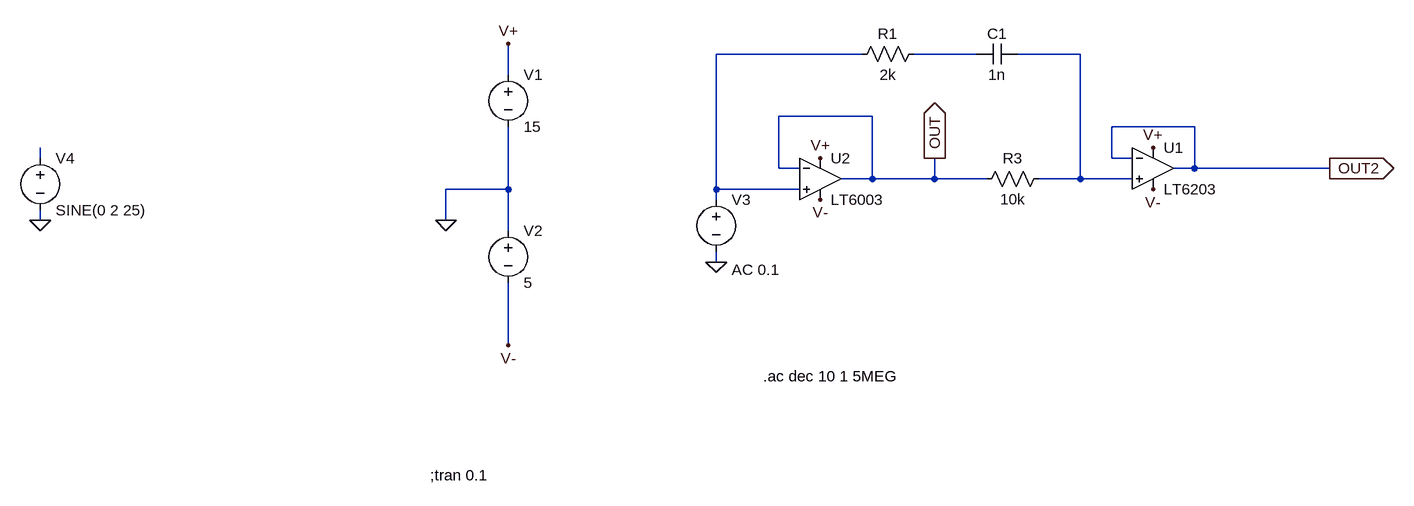
[diagram p0: schematic ac_bypass.asc]
ac_bypass.asc, the LTspice schematic file:
Version 4
SHEET 1 956 700
WIRE 112 32 -112 32
WIRE 288 32 192 32
WIRE 448 32 352 32
WIRE -432 64 -432 16
WIRE 128 128 -16 128
WIRE 624 144 496 144
WIRE -1152 192 -1152 176
WIRE 496 192 496 144
WIRE 528 192 496 192
WIRE -16 208 -16 128
WIRE 16 208 -16 208
WIRE 624 208 624 144
WIRE 624 208 592 208
WIRE 832 208 624 208
WIRE 128 224 128 128
WIRE 128 224 80 224
WIRE 224 224 224 192
WIRE 224 224 128 224
WIRE 304 224 224 224
WIRE 448 224 448 32
WIRE 448 224 384 224
WIRE 528 224 448 224
WIRE -432 240 -432 144
WIRE -432 240 -528 240
WIRE -112 240 -112 32
WIRE 16 240 -112 240
WIRE -112 256 -112 240
WIRE -1152 288 -1152 272
WIRE -528 288 -528 240
WIRE -432 304 -432 240
WIRE -112 352 -112 336
WIRE -432 480 -432 384
FLAG -528 288 0
FLAG -432 16 V+
FLAG -432 480 V-
FLAG 48 256 V-
FLAG 48 192 V+
FLAG -112 352 0
FLAG 224 192 OUT
IOPIN 224 192 Out
FLAG -1152 288 0
FLAG 560 176 V+
FLAG 560 240 V-
FLAG 832 208 OUT2
IOPIN 832 208 Out
SYMBOL voltage -432 48 R0
WINDOW 123 0 0 Left 0
WINDOW 39 0 0 Left 0
SYMATTR InstName V1
SYMATTR Value 15
SYMBOL voltage -432 288 R0
WINDOW 123 0 0 Left 0
WINDOW 39 0 0 Left 0
SYMATTR InstName V2
SYMATTR Value 5
SYMBOL voltage -112 240 R0
WINDOW 123 24 124 Left 2
WINDOW 39 0 0 Left 0
SYMATTR Value2 AC 0.1
SYMATTR InstName V3
SYMATTR Value ""
SYMBOL Opamps\\LT6003 48 224 R0
SYMATTR InstName U2
SYMBOL voltage -1152 176 R0
WINDOW 123 0 0 Left 0
WINDOW 39 0 0 Left 0
SYMATTR InstName V4
SYMATTR Value SINE(0 2 25)
SYMBOL Opamps\\LT6203 560 208 R0
SYMATTR InstName U1
SYMBOL res 400 208 R90
WINDOW 0 0 56 VBottom 2
WINDOW 3 32 56 VTop 2
SYMATTR InstName R3
SYMATTR Value 10k
SYMBOL cap 352 16 R90
WINDOW 0 0 32 VBottom 2
WINDOW 3 32 32 VTop 2
SYMATTR InstName C1
SYMATTR Value 1n
SYMBOL res 208 16 R90
WINDOW 0 0 56 VBottom 2
WINDOW 3 32 56 VTop 2
SYMATTR InstName R1
SYMATTR Value 2k
TEXT -552 680 Left 2 !;tran 0.1
TEXT -40 528 Left 2 !.ac dec 10 1 5MEG

The netlist it stands for:
* ac_bypass.asc
V1 V+ 0 15
V2 0 V- 5
V3 N001 0 AC 0.1
* U2: LT6003 (symbol Opamps\LT6003 not available, pins judged from their places): In+=N001 In-=OUT V+=V+ V-=V- OUT=OUT
V4 N004 0 SINE(0 2 25)
* U1: LT6203 (symbol Opamps\LT6203 not available, pins judged from their places): In+=N003 In-=OUT2 V+=V+ V-=V- OUT=OUT2
R3 N003 OUT 10k
C1 N003 N002 1n
R1 N002 N001 2k
;tran 0.1
.ac dec 10 1 5MEG
.backanno
.end